# EAGLE design Accessory - ADC v3 (EAGLE 5.06)
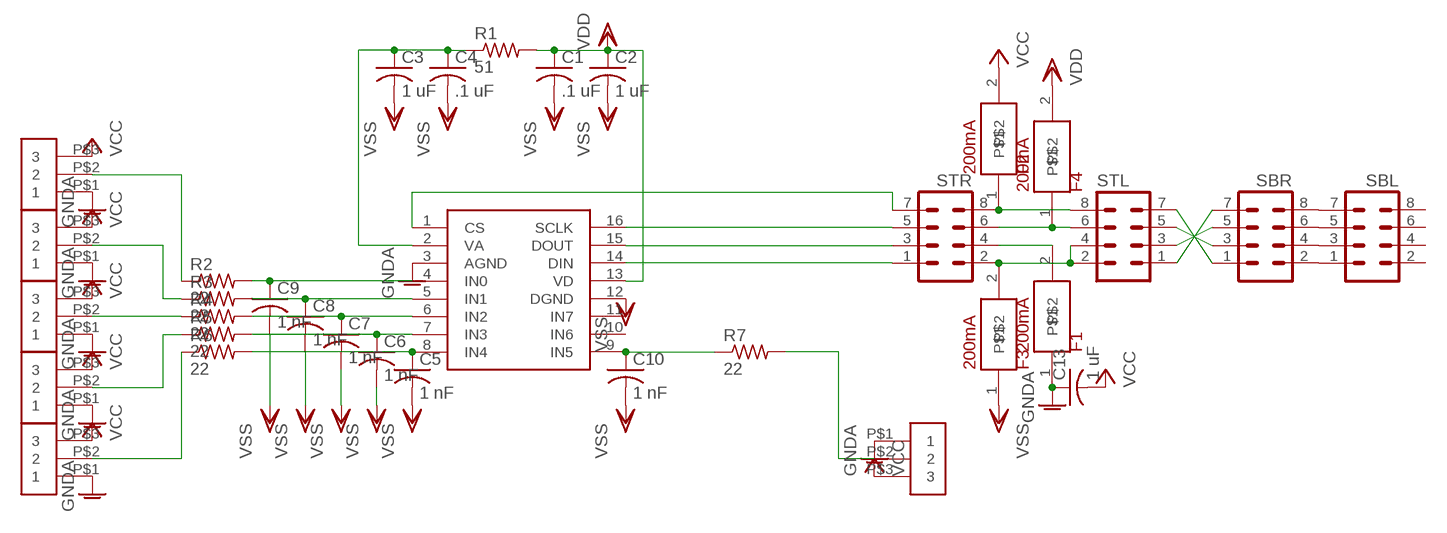
[diagram p0: schematic, sheet 1]

## Parts
C1  .1 uF  C-USC0603  [C0603]
C2  1 uF  C-USC0603  [C0603]
C3  1 uF  C-USC0603  [C0603]
C4  .1 uF  C-USC0603  [C0603]
C5  1 nF  C-USC0201  [C0201]
C6  1 nF  C-USC0201  [C0201]
C7  1 nF  C-USC0201  [C0201]
C8  1 nF  C-USC0201  [C0201]
C9  1 nF  C-USC0201  [C0201]
C10  1 nF  C-USC0201  [C0201]
C13  1 uF  C-USC0603  [C0603]
F1  200mA  FUSE  [R0603]
F2  200mA  FUSE  [R0603]
F3  200mA  FUSE  [R0603]
F4  200mA  FUSE  [R0603]
R1  51  R-US_R0603  [R0603]
R2  22  R-US_R0201  [R0201]
R3  22  R-US_R0201  [R0201]
R4  22  R-US_R0201  [R0201]
R5  22  R-US_R0201  [R0201]
R6  22  R-US_R0201  [R0201]
R7  22  R-US_R0201  [R0201]
SBL  MA04-2  [MA04-2]
SBR  MA04-2  [MA04-2]
STL  MA04-2  [MA04-2]
STR  MA04-2  [MA04-2]
U$1  ADC128S102  ADC128S102TSSOP16  [TSSOP16]
U$4  292207-3  [292207-3]
U$5  292207-3  [292207-3]
U$6  292207-3  [292207-3]
U$7  292207-3  [292207-3]
U$8  292207-3  [292207-3]
U$9  292207-3  [292207-3]

## Nets
GNDA: C13.1 F1.1 U$1.3(AGND) U$4.P$1 U$5.P$1 U$6.P$1 U$7.P$1 U$8.P$1 U$9.P$1
N$1: C5.1 R6.2 U$1.8(IN4)
N$2: C10.1 R7.1 U$1.9(IN5)
N$3: C6.1 R5.2 U$1.7(IN3)
N$4: C7.1 R4.2 U$1.6(IN2)
N$5: C8.1 R3.2 U$1.5(IN1)
N$6: C9.1 R2.2 U$1.4(IN0)
N$7: SBR.7 STL.1
N$8: SBR.1 STL.7
N$9: SBR.3 STL.5
N$10: SBR.5 STL.3
N$14: SBL.1 SBR.2
N$15: SBL.3 SBR.4
N$16: SBL.5 SBR.6
N$17: SBL.7 SBR.8
N$18: STR.7 U$1.1(CS)
N$19: STR.5 U$1.16(SCLK)
N$20: F4.1 STL.6 STR.6
N$21: F3.2 STL.2 STL.4 STR.2
N$22: STR.3 U$1.15(DOUT)
N$23: STR.1 U$1.14(DIN)
N$24: F1.2 STR.4
N$25: R2.1 U$9.P$2
N$26: R3.1 U$5.P$2
N$27: R4.1 U$6.P$2
N$28: R5.1 U$7.P$2
N$29: R6.1 U$8.P$2
N$32: R7.2 U$4.P$2
N$33: F2.1 STL.8 STR.8
N$34: C3.1 C4.1 R1.1 U$1.2(VA)
VCC: C13.2 F2.2 U$4.P$3 U$5.P$3 U$6.P$3 U$7.P$3 U$8.P$3 U$9.P$3
VDD: C1.1 C2.1 F4.2 R1.2 U$1.13(VD)
VSS: C1.2 C2.2 C3.2 C4.2 C5.2 C6.2 C7.2 C8.2 C9.2 C10.2 F3.1 U$1.12(DGND)
Unconnected: SBL.2 SBL.4 SBL.6 SBL.8 U$1.10(IN6) U$1.11(IN7)

## Library data of the parts
C1-C10 C13 = rcl:C-US: CAPACITOR, American symbol
F1-F4 = rcl:FUSE
R1-R7 = rcl:R-US_: RESISTOR, American symbol
SBL SBR STL STR = con-lstb:MA04-2: PIN HEADER
U$1 = ref-packages:ADC128S102
U$4-U$9 = con-tyco:292207-3

## Board
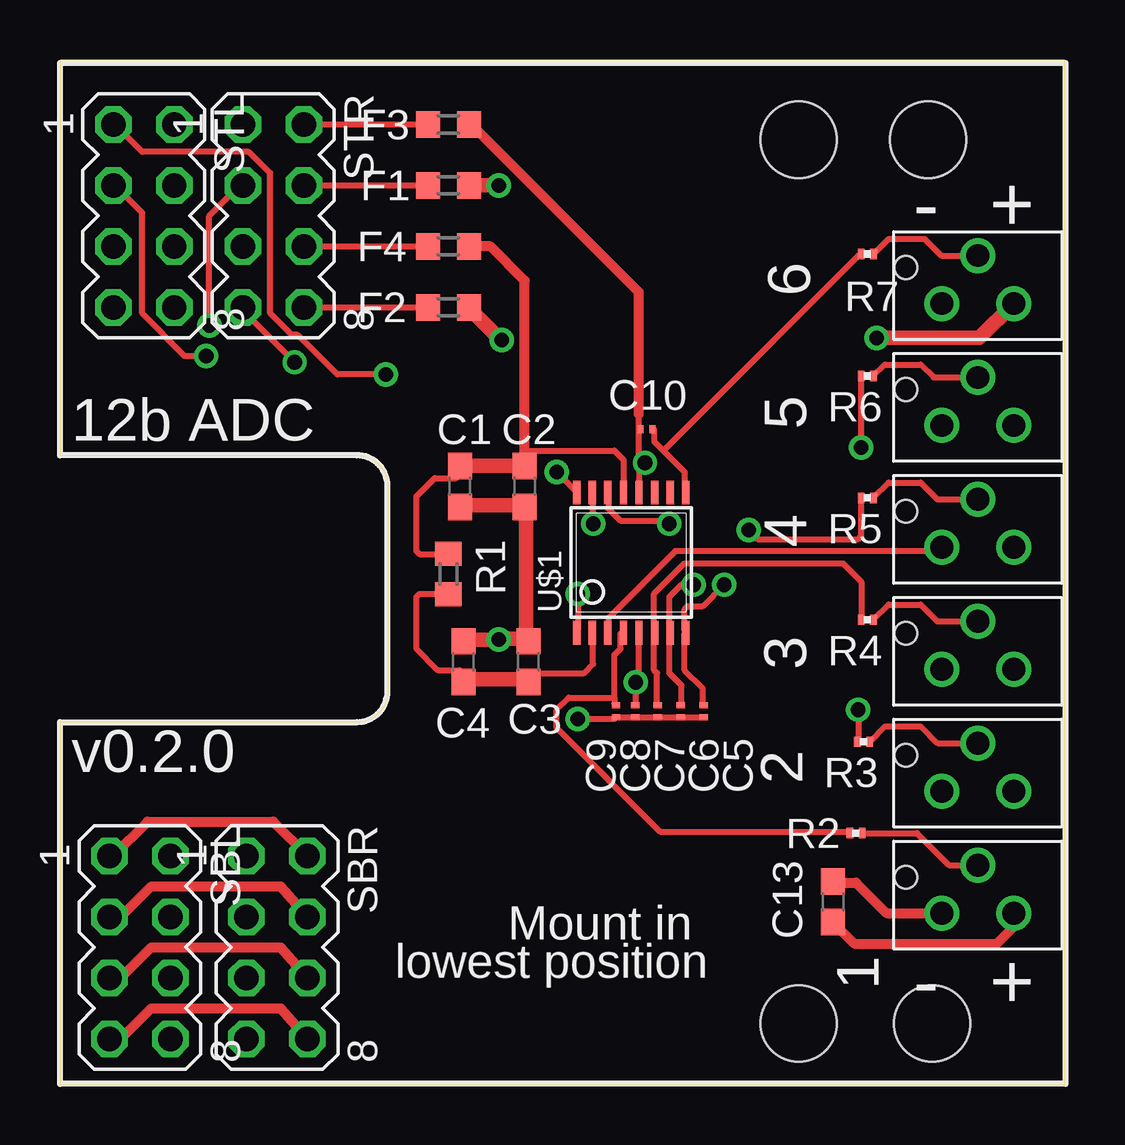
[diagram p1: board, top side]
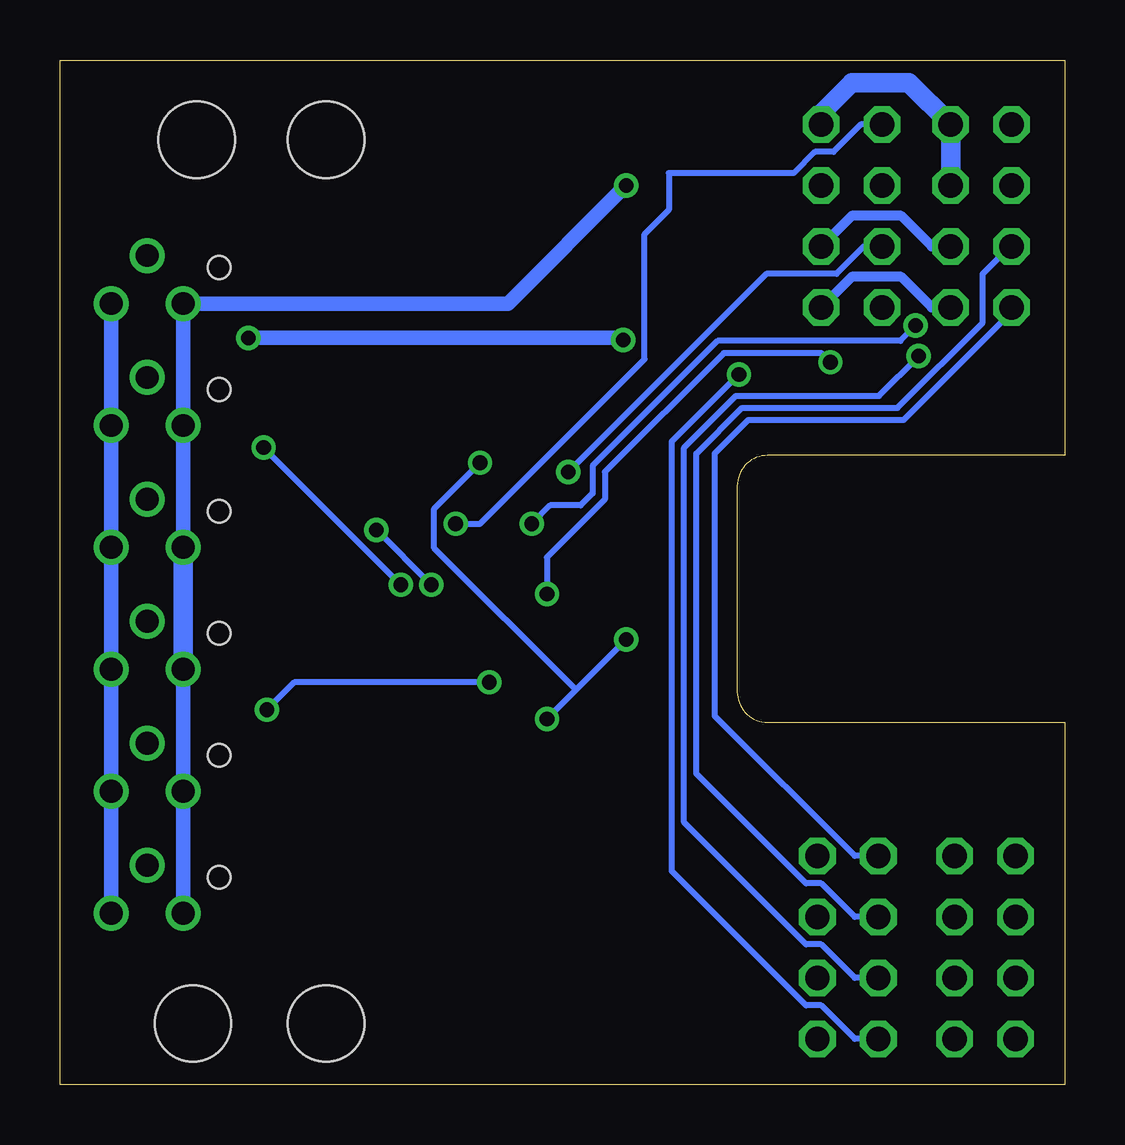
[diagram p2: board, bottom side, seen from below]

Size 41.89 x 42.69 mm. Coordinates in mm from the lower left corner, seen from the top.
Outline: 0,0 41.89,0 41.89,42.69 0,42.69 0,26.22 12.39,26.22 arc-90 13.66,24.95 13.66,16.36 arc-90 12.39,15.1 0,15.1 0,0
Copper layers (1*16): Top 0.035mm / dielectric 1.5mm / Bottom 0.035mm
Design rules "default": minimum track width 10mil, minimum drill 24mil, track to track 8mil, track to pad 8mil, pad to pad 8mil, via to via 8mil, smd to smd 8mil, copper to edge 40mil, drill to drill 8mil, minimum pad ring 10mil, minimum via ring 8mil, stop-mask expansion 4mil, vias tented up to drill 0mil, thermal gap 10mil
Holes 3.17 mm at 30.8,39.37 36.2,39.37 30.8,2.54 36.35,2.54

### Footprints (pad centres in the part's own frame; a part is rotated, then mirrored left to right if it is on the bottom)
C0603 = smd 1.1 x 1: 1 -0.85,0; 2 0.85,0
C0201 = smd 0.25 x 0.35: 1 -0.25,0; 2 0.25,0
R0603 = smd 1 x 1.1: 1 -0.85,0; 2 0.85,0
R0201 = smd 0.28 x 0.43: 1 -0.255,0; 2 0.255,0
MA04-2 = drill 1.016 octagon: 1 -3.81,-1.27; 2 -3.81,1.27; 3 -1.27,-1.27; 4 -1.27,1.27; 5 1.27,-1.27; 6 1.27,1.27; 7 3.81,-1.27; 8 3.81,1.27
TSSOP16 = smd 0.305 x 0.991: 1 -2.275,-2.918; 2 -1.625,-2.918; 3 -0.975,-2.918; 4 -0.325,-2.918; 5 0.325,-2.918; 6 0.975,-2.918; 7 1.625,-2.918; 8 2.275,-2.918; 9 2.275,2.918; 10 1.625,2.918; 11 0.975,2.918; 12 0.325,2.918; 13 -0.325,2.918; 14 -0.975,2.918; 15 -1.625,2.918; 16 -2.275,2.918
292207-3 = drill 0.95 round: P$1 -1.5,0; P$2 0,2; P$3 1.5,0 | hole 0.95: -3,1.5

### Placement (x,y rotation side)
C1  16.67,24.92 270 top
C2  19.37,24.92 270 top
C3  19.53,17.62 90 top
C4  16.83,17.62 90 top
C5  26.83,15.56 270 top
C6  25.88,15.56 270 top
C7  24.92,15.56 270 top
C8  23.97,15.56 270 top
C9  23.18,15.56 270 top
C10  24.45,27.3 180 top
C13  32.23,7.62 270 top
F1  16.19,37.47 180 top
F2  16.19,32.38 0 top
F3  16.19,40.01 180 top
F4  16.19,34.92 0 top
R1  16.19,21.27 90 top
R2  33.18,10.48 180 top
R3  33.5,14.29 180 top
R4  33.66,19.37 180 top
R5  33.66,24.45 180 top
R6  33.66,29.53 180 top
R7  33.66,34.61 0 top
SBL  3.33,5.71 270 top
SBR  9.05,5.71 270 top
STL  3.49,36.2 270 top
STR  8.89,36.2 270 top
U$1  23.81,21.75 0 top
U$4  38.26,32.54 0 top
U$5  38.26,12.22 0 top
U$6  38.26,17.3 0 top
U$7  38.26,22.38 0 top
U$8  38.26,27.46 0 top
U$9  38.26,7.14 0 top

### Tracks (layer width: path | path; a pad name or v marks a point on that pad's centre or on a via)
GNDA  (via drill 0.61)
  Top 0.254: U$1.3 22.86,18.92 22.86,19.43 25.65,22.23 36.58,22.23 36.7,22.35 U$7.P$1 | 17.14,37.47 F1.1
  Top 0.406: U$9.P$1 34.45,7.14 33.18,8.41 32.28,8.41 C13.1
  Top 0.61: v18.29,37.47 17.14,37.47
  Bottom 0.254: U$4.P$1 36.58,32.38
  Bottom 0.61: U$7.P$1 U$8.P$1 U$4.P$1 23.21,32.54 v18.29,37.47 | U$6.P$1 | U$5.P$1 U$6.P$1 | U$5.P$1 | U$9.P$1 U$5.P$1
  Bottom 0.813: U$6.P$1 U$7.P$1 | U$6.P$1
N$1  (via drill 0.61)
  Top 0.254: C5.1 26.8,15.88 26.8,16.51 26.04,17.27 26.04,18.8 U$1.8 26.04,18.92 26.04,19.81 26.16,19.94 26.8,19.94 v27.69,20.83 | v33.4,26.54 33.4,29.46 R6.2
  Bottom 0.254: v27.69,20.83 v33.4,26.54
N$2
  Top 0.254: 25.15,26.42 26.04,25.53 26.04,24.77 U$1.9 | 25.15,26.42 24.77,26.8 24.77,27.3 C10.1 | 25.15,26.42 33.27,34.54 R7.1
N$3  (via drill 0.61)
  Top 0.254: C6.1 25.91,15.88 25.91,16.64 25.4,17.14 25.4,18.8 U$1.7 25.4,18.92 25.4,20.32 25.91,20.83 v26.42,20.83 | v28.7,23.11 29.08,22.73 33.27,22.73 33.4,22.86 33.4,24.38 R5.2
  Bottom 0.254: v26.42,20.83 v28.7,23.11
N$4
  Top 0.254: C7.1 24.89,15.88 24.89,17.14 24.77,17.27 24.77,18.8 U$1.6 24.77,18.92 24.77,20.45 26.04,21.72 32.64,21.72 33.4,20.95 33.4,19.43 R4.2
N$5  (via drill 0.61)
  Top 0.254: C8.1 24,15.88 v24,16.76 24,17.14 24.13,17.27 24.13,18.8 U$1.5 | v33.27,15.62 33.27,14.35 R3.2
  Bottom 0.254: v33.27,15.62 32.13,16.76 v24,16.76
N$6
  Top 0.254: 23.11,16.13 23.11,17.91 23.37,18.16 23.37,18.8 U$1.4 | 23.11,16.13 23.11,15.88 C9.1 | 23.11,16.13 21.21,16.13 20.7,15.62 20.7,14.86 25.02,10.54 32.89,10.54 R2.2
N$7  (via drill 0.61)
  Top 0.254: v13.59,29.59 11.56,29.59 9.91,31.24 9.65,31.24 8.76,32.13 8.76,37.97 7.87,38.86 3.43,38.86 2.29,40.01 STL.1
  Bottom 0.254: v13.59,29.59 16.38,26.8 16.38,8.89 10.79,3.3 10.16,3.3 8.76,1.91 SBR.7
N$8
  Bottom 0.254: SBR.1 8.76,9.53 14.61,15.37 14.61,26.29 13.21,27.69 6.73,27.69 2.29,32.13 2.29,32.38 STL.7
N$9
  Bottom 0.254: SBR.3 8.76,6.99 10.16,8.38 10.79,8.38 15.37,12.95 15.37,26.29 13.46,28.19 6.99,28.19 3.43,31.75 3.43,33.78 2.29,34.92 STL.5
N$10  (via drill 0.61)
  Top 0.254: v6.1,30.35 5.21,30.35 3.43,32.13 3.43,36.32 2.29,37.47 STL.3
  Bottom 0.254: v6.1,30.35 7.75,28.7 13.72,28.7 15.88,26.54 15.88,10.92 10.79,5.84 10.16,5.84 8.76,4.45 SBR.5
N$14
  Top 0.406: SBL.1 2.22,9.53 3.65,10.95 8.89,10.95 SBR.2
N$15
  Top 0.406: SBL.3 2.54,6.99 3.81,8.26 9.21,8.26 SBR.4
N$16
  Top 0.406: SBL.5 2.54,4.45 3.81,5.71 9.21,5.71 SBR.6
N$17
  Top 0.406: SBL.7 2.54,1.91 3.81,3.17 9.21,3.17 SBR.8
N$18  (via drill 0.61)
  Top 0.254: v21.59,20.45 21.59,18.92 U$1.1 | v9.78,30.1 7.75,32.13 7.75,32.38 STR.7
  Bottom 0.254: v21.59,20.45 21.59,21.97 19.18,24.38 19.18,25.53 14.22,30.48 10.16,30.48 v9.78,30.1
N$19  (via drill 0.61)
  Top 0.254: v20.7,25.53 21.46,24.77 U$1.16
  Bottom 0.254: v20.7,25.53 12.45,33.78 9.53,33.78 8.38,34.92 7.75,34.92 STR.5
N$20
  Top 0.254: F4.1 10.29,34.92 STR.6
  Bottom 0.406: STL.6 5.56,34.92 6.83,36.2 8.89,36.2 STR.6
N$21
  Top 0.254: F3.2 10.29,40.01 STR.2
  Bottom 0.254: STL.2 4.83,40.13 | 10.16,40.13 STR.2
  Bottom 0.406: 10.16,40.16 10.16,40.13
  Bottom 0.813: STL.4 STL.2 6.51,41.75 8.89,41.75 10.16,40.48 10.16,40.16
N$22  (via drill 0.61)
  Top 0.254: v22.23,23.37 22.23,24.64 U$1.15 | v6.22,31.62 6.22,36.2 7.62,37.59 STR.3
  Bottom 0.254: v22.23,23.37 21.46,24.13 20.19,24.13 19.68,24.64 19.68,25.78 14.48,30.99 6.86,30.99 v6.22,31.62
N$23  (via drill 0.61)
  Top 0.254: v25.4,23.37 25.27,23.5 23.37,23.5 22.86,24 22.86,24.64 U$1.14
  Bottom 0.254: v25.4,23.37 24.38,23.37 17.53,30.23 17.53,35.43 16.51,36.45 16.51,37.97 11.3,37.97 10.41,38.86 9.65,38.86 8.51,40.01 7.75,40.01 STR.1
N$24
  Top 0.254: F1.2 15.24,37.47 10.29,37.47 STR.4
N$25
  Top 0.254: U$9.P$2 37.05,9.14 35.72,10.48 R2.1
N$26
  Top 0.254: U$5.P$2 36.58,14.22 35.88,14.92 34.39,14.92 R3.1
N$27
  Top 0.254: U$6.P$2 36.58,19.3 35.88,20 34.55,20 R4.1
N$28
  Top 0.254: U$7.P$2 36.58,24.38 35.88,25.08 34.55,25.08 R5.1
N$29
  Top 0.254: U$8.P$2 36.42,29.46 35.88,30 34.39,30 R6.1
N$32
  Top 0.254: U$4.P$2 36.73,34.54 36.04,35.24 34.55,35.24 R7.2
N$33
  Top 0.254: F2.1 10.29,32.38 STR.8
  Bottom 0.406: STL.8 5.56,32.38 6.83,33.66 8.89,33.66 STR.8
N$34
  Top 0.254: U$1.2 22.23,18.8 22.23,17.53 21.84,17.14 19.68,17.14 19.43,16.89 C3.1 | R1.1 16.13,20.45 14.99,20.45 14.86,20.32 14.86,18.16 15.75,17.27 16.64,17.27 16.76,17.14 16.76,16.89 C4.1
  Top 0.61: 19.43,16.89 16.83,16.89 C4.1
VCC  (via drill 0.61)
  Top 0.254: 17.02,32.38 F2.2
  Top 0.406: U$9.P$3 39.76,6.58 39.05,5.87 33.12,5.87 C13.2
  Top 0.61: 17.02,32.38 18.38,31.02 v18.41,31.02 | v34.04,31.11 38.33,31.11 U$4.P$3
  Bottom 0.61: U$5.P$3 | U$9.P$3 U$5.P$3 | U$5.P$3 | U$5.P$3 U$6.P$3 | U$6.P$3 | U$6.P$3 U$7.P$3 U$8.P$3 U$4.P$3 | v18.41,31.02 18.51,31.11 v34.04,31.11
VDD
  Top 0.254: R1.2 16.13,22.1 14.99,22.1 14.86,22.23 14.86,24.51 15.62,25.27 16.51,25.27 16.64,25.4 16.64,25.65 C1.1 16.64,25.78 | U$1.13 23.5,24.77 23.5,26.04 23.11,26.42 19.43,26.42 19.43,25.78 C2.1 | F4.2 17.02,34.92
  Top 0.406: F4.2 17.94,34.92 19.37,33.5 C2.1
  Top 0.61: 16.64,25.78 C2.1
VSS  (via drill 0.61)
  Top 0.254: 16.64,24 C1.2 16.76,24.13 | C6.2 C7.2 C8.2 C9.2 23.11,15.24 v21.59,15.24 | C6.2 C5.2 | C6.2 | 19.3,24.13 C2.2 19.43,24 | C4.2 16.89,18.54 | 19.43,18.54 C3.2 19.43,18.67 | 24.13,25.91 24.13,24.77 U$1.12 | 24.13,25.91 24.13,27.3 | 24.13,27.3 24.13,27.94 24.13,32 | 17.14,40.01 F3.1 | 24.13,27.3 C10.2 | v24.38,25.91 24.13,25.91
  Top 0.406: 17.14,40.01 24.13,33.02 24.13,27.94
  Top 0.61: 19.43,18.57 19.43,24 | 19.43,18.57 C3.2 | 16.76,24.13 19.31,24.13 C2.2 | 19.43,18.57 18.31,18.57 v18.29,18.54 16.89,18.54
  Bottom 0.254: v18.29,18.54 20.38,16.45 | 20.38,16.45 v21.59,15.24 | v24.38,25.91 26.29,24 26.29,22.35 20.38,16.45

### Text on the board
tNames: - | + | 6 | 12b ADC | 5 | 4 | 3 | v0.2.0 | 2 | Mount in | lowest position | 1 | - | +